# EAGLE design IP_04_00_000-PendulumSchem (EAGLE 9.6.2)
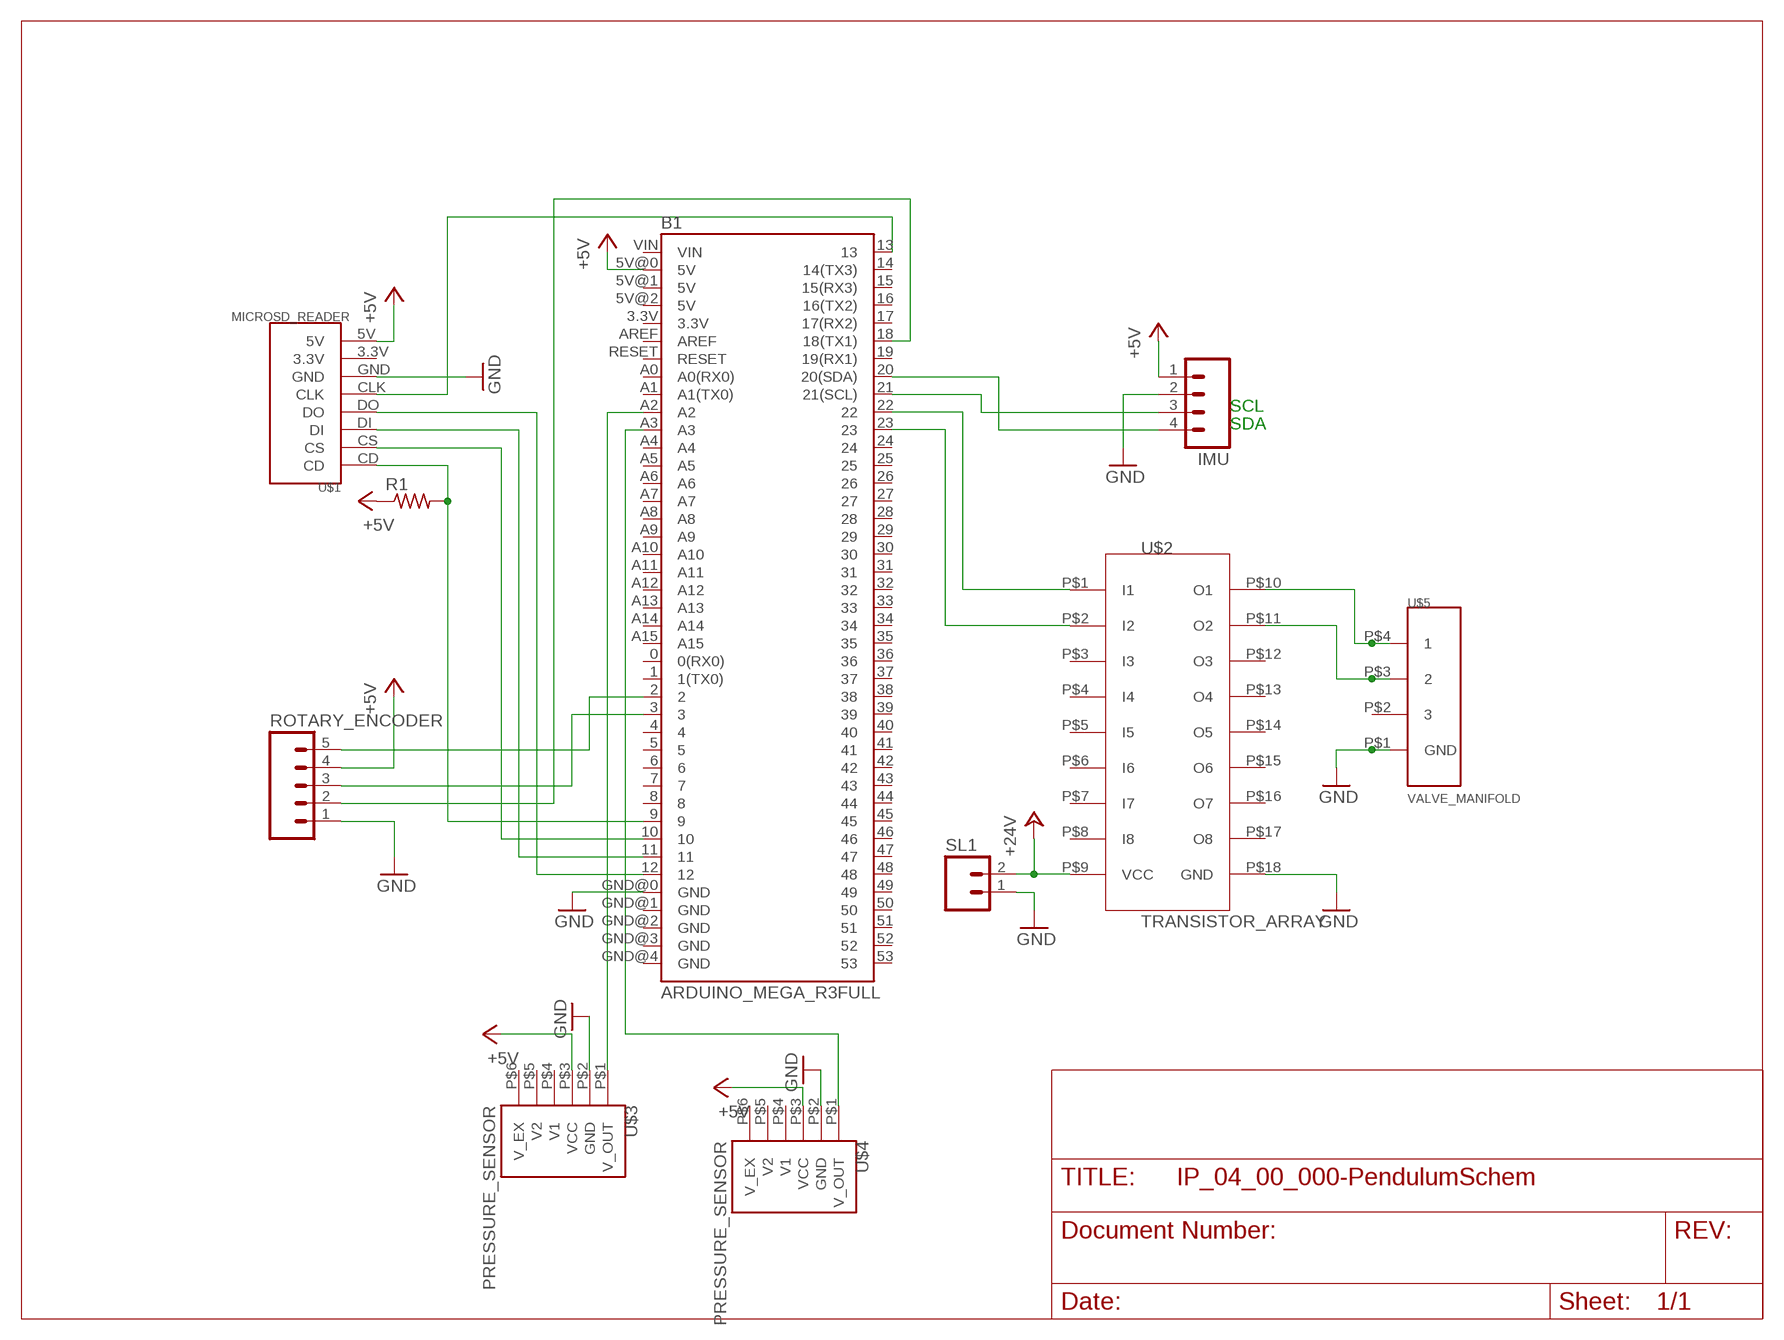
[diagram p0: schematic, sheet 1]

## Parts
B1  ARDUINO_MEGA_R3FULL  [ARDUINO_MEGA]
IMU  M04  [04P]
R1  R-US_0204/7  [0204/7]
ROTARY_ENCODER  M05  [05P]
SL1  M02  [02P]
U$1  MICROSD_READER  [MICROSD_READER]
U$2  TRANSISTOR_ARRAY  [TRANSISTOR_ARRAY]
U$3  PRESSURE_SENSOR  [PRESSURE_SENSOR]
U$4  PRESSURE_SENSOR  [PRESSURE_SENSOR]
U$5  VALVE_MANIFOLD  [VALVE_MANIFOLD]

## Nets
+5V: B1.5V@0(5V) IMU.1 R1.1 ROTARY_ENCODER.4 U$1.5V U$3.P$3(VCC) U$4.P$3(VCC)
+24V: SL1.2 U$2.P$9(VCC)
GND: B1.GND@0(GND) IMU.2 ROTARY_ENCODER.1 SL1.1 U$1.GND U$2.P$18(GND) U$3.P$2(GND) U$4.P$2(GND) U$5.P$1(GND)
N$1: B1.3 ROTARY_ENCODER.3
N$2: B1.20(20(SDA)) IMU.4
N$3: B1.21(21(SCL)) IMU.3
N$4: B1.2 ROTARY_ENCODER.5
N$5: B1.22 U$2.P$1(I1)
N$6: U$2.P$10(O1) U$5.P$4
N$7: B1.18(18(TX1)) ROTARY_ENCODER.2
N$8: U$2.P$11(O2) U$5.P$3
N$10: B1.23 U$2.P$2(I2)
N$11: B1.13 U$1.CLK
N$12: B1.A2 U$3.P$1(V_OUT)
N$13: B1.12 U$1.DO
N$14: B1.A3 U$4.P$1(V_OUT)
N$15: B1.11 U$1.DI
N$16: B1.10 U$1.CS
N$18: B1.9 R1.2 U$1.CD
Unconnected: B1.0(0(RX0)) B1.1(1(TX0)) B1.3.3V B1.4 B1.5 B1.5V@1(5V) B1.5V@2(5V) B1.6 B1.7 B1.8 B1.14(14(TX3)) B1.15(15(RX3)) B1.16(16(TX2)) B1.17(17(RX2)) B1.19(19(RX1)) B1.24 B1.25 B1.26 B1.27 B1.28 B1.29 B1.30 B1.31 B1.32 B1.33 B1.34 B1.35 B1.36 B1.37 B1.38 B1.39 B1.40 B1.41 B1.42 B1.43 B1.44 B1.45 B1.46 B1.47 B1.48 B1.49 B1.50 B1.51 B1.52 B1.53 B1.A0(A0(RX0)) B1.A1(A1(TX0)) B1.A4 B1.A5 B1.A6 B1.A7 B1.A8 B1.A9 B1.A10 B1.A11 B1.A12 B1.A13 B1.A14 B1.A15 B1.AREF B1.GND@1(GND) B1.GND@2(GND) B1.GND@3(GND) B1.GND@4(GND) B1.RESET B1.VIN U$1.3.3V U$2.P$3(I3) U$2.P$4(I4) U$2.P$5(I5) U$2.P$6(I6) U$2.P$7(I7) U$2.P$8(I8) U$2.P$12(O3) U$2.P$13(O4) U$2.P$14(O5) U$2.P$15(O6) U$2.P$16(O7) U$2.P$17(O8) U$3.P$4(V1) U$3.P$5(V2) U$3.P$6(V_EX) U$4.P$4(V1) U$4.P$5(V2) U$4.P$6(V_EX) U$5.P$2

## Notes on the sheet
- SCL
- SDA

## Library data of the parts
B1 = SparkFun-Boards-deleted2holes:ARDUINO_MEGA_R3: Arduino Mega R3 ATmega2560 R3 compatible footprint. SparkFun Products: Arduino Mega 2560 R3 <https://www.sparkfun.com/products/11061>
IMU = con-amp-quick:M04: AMP QUICK CONNECTOR; OC_FARNELL: unknown; OC_NEWARK: unknown
R1 = rcl:R-US_: RESISTOR, American symbol; SPICEPREFIX: R
ROTARY_ENCODER = con-amp-quick:M05: AMP QUICK CONNECTOR; OC_FARNELL: unknown; OC_NEWARK: unknown
SL1 = con-amp-quick:M02: AMP QUICK CONNECTOR; OC_FARNELL: unknown; OC_NEWARK: unknown
U$1 = IPcustomDevices:MICROSD_READER
U$2 = IPcustomDevices:TRANSISTOR_ARRAY
U$3 U$4 = IPcustomDevices:PRESSURE_SENSOR
U$5 = IPcustomDevices:VALVE_MANIFOLD

## Board
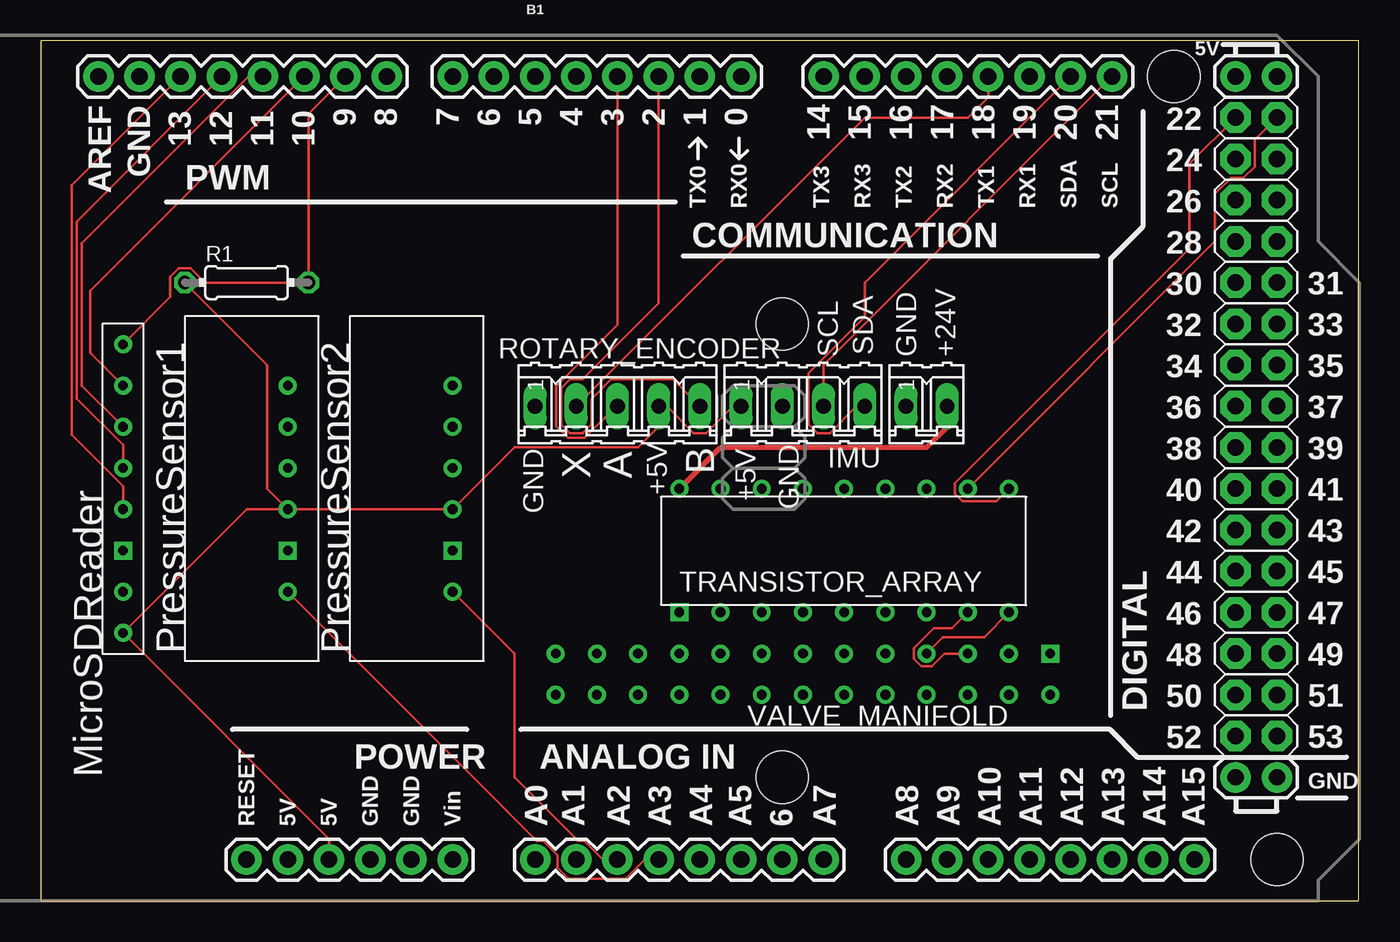
[diagram p1: board, top side]
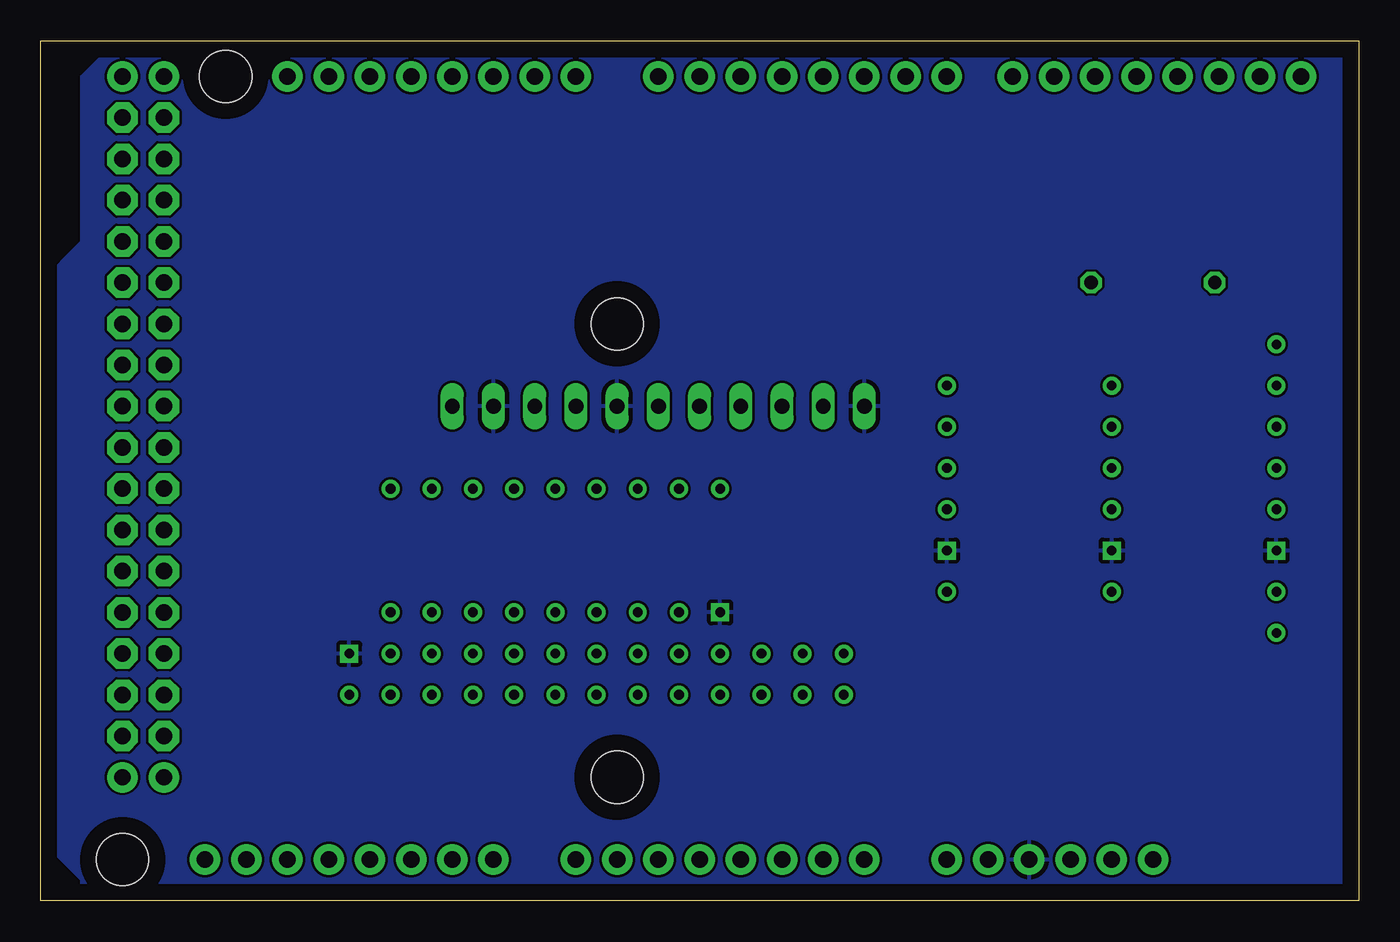
[diagram p2: board, bottom side, seen from below]

Size 81.26 x 53.01 mm. Coordinates in mm from the lower left corner, seen from the top.
Outline: 0,0 81.26,0 81.26,53.01 0,53.01 0,0
Copper layers (1*16): Top 0.035mm / dielectric 1.5mm / Bottom 0.035mm
Design rules "default": minimum track width 6mil, minimum drill 0.35mm, track to track 6mil, track to pad 6mil, pad to pad 6mil, via to via 6mil, smd to smd 6mil, copper to edge 40mil, drill to drill 6mil, minimum pad ring 10mil, minimum via ring 8mil, stop-mask expansion 4mil, vias tented up to drill 0mil, thermal gap 10mil

### Footprints (pad centres in the part's own frame; a part is rotated, then mirrored left to right if it is on the bottom)
ARDUINO_MEGA = drill 1.016 pad 1.88: 0 13.97,24.13; 1 11.43,24.13; 2 8.89,24.13; 3 6.35,24.13; 3.3V -13.97,-24.13; 4 3.81,24.13; 5 1.27,24.13; 5V@0 -11.43,-24.13; 5V@1 44.45,24.13; 5V@2 46.99,24.13; 6 -1.27,24.13; 7 -3.81,24.13; 8 -7.874,24.13; 9 -10.414,24.13; 10 -12.954,24.13; 11 -15.494,24.13; 12 -18.034,24.13; 13 -20.574,24.13; 14 19.05,24.13; 15 21.59,24.13; 16 24.13,24.13; 17 26.67,24.13; 18 29.21,24.13; 19 31.75,24.13; 20 34.29,24.13; 21 36.83,24.13; A0 1.27,-24.13; A1 3.81,-24.13; A2 6.35,-24.13; A3 8.89,-24.13; A4 11.43,-24.13; A5 13.97,-24.13; A6 16.51,-24.13; A7 19.05,-24.13; A8 24.13,-24.13; A9 26.67,-24.13; A10 29.21,-24.13; A11 31.75,-24.13; A12 34.29,-24.13; A13 36.83,-24.13; A14 39.37,-24.13; A15 41.91,-24.13; AREF -25.654,24.13; GND@0 -8.89,-24.13; GND@1 -6.35,-24.13; GND@2 44.45,-19.05; GND@3 46.99,-19.05; GND@4 -23.114,24.13; RESET -16.51,-24.13; VIN -3.81,-24.13 | drill 1.016 pad 1.88 octagon: 22 44.45,21.59; 23 46.99,21.59; 24 44.45,19.05; 25 46.99,19.05; 26 44.45,16.51; 27 46.99,16.51; 28 44.45,13.97; 29 46.99,13.97; 30 44.45,11.43; 31 46.99,11.43; 32 44.45,8.89; 33 46.99,8.89; 34 44.45,6.35; 35 46.99,6.35; 36 44.45,3.81; 37 46.99,3.81; 38 44.45,1.27; 39 46.99,1.27; 40 44.45,-1.27; 41 46.99,-1.27; 42 44.45,-3.81; 43 46.99,-3.81; 44 44.45,-6.35; 45 46.99,-6.35; 46 44.45,-8.89; 47 46.99,-8.89; 48 44.45,-11.43; 49 46.99,-11.43; 50 44.45,-13.97; 51 46.99,-13.97; 52 44.45,-16.51; 53 46.99,-16.51 | hole 3.2: 16.51,8.89; 16.51,-19.05; 40.64,24.13; 46.99,-24.13
04P = drill 0.914 long: 1 -3.81,0; 2 -1.27,0; 3 1.27,0; 4 3.81,0
0204/7 = drill 0.813 octagon: 1 -3.81,0; 2 3.81,0
05P = drill 0.914 long: 1 -5.08,0; 2 -2.54,0; 3 0,0; 4 2.54,0; 5 5.08,0
02P = drill 0.914 long: 1 -1.27,0; 2 1.27,0
MICROSD_READER = drill 0.6: 3.3V 0,-2.54; 5V 0,-5.08; CD 0,12.7; CLK 0,2.54; CS 0,10.16; DI 0,7.62; DO 0,5.08 | drill 0.6 square: GND 0,0
TRANSISTOR_ARRAY = drill 0.6: P$1 0,0; P$2 0,-2.54; P$3 0,-5.08; P$4 0,-7.62; P$5 0,-10.16; P$6 0,-12.7; P$7 0,-15.24; P$8 0,-17.78; P$9 0,-20.32; P$10 7.62,0; P$11 7.62,-2.54; P$12 7.62,-5.08; P$13 7.62,-7.62; P$14 7.62,-10.16; P$15 7.62,-12.7; P$16 7.62,-15.24; P$17 7.62,-17.78 | drill 0.6 square: P$18 7.62,-20.32
PRESSURE_SENSOR = drill 0.6: P$1 0,0; P$3 0,5.08; P$4 0,7.62; P$5 0,10.16; P$6 0,12.7 | drill 0.6 square: P$2 0,2.54
VALVE_MANIFOLD = drill 0.6 square: P$1 0,0 | drill 0.6: P$2 0,2.54; P$3 0,5.08; P$4 0,7.62; P$5 0,10.16; P$6 0,12.7; P$7 0,15.24; P$8 0,17.78; P$9 0,20.32; P$10 0,22.86; P$11 0,25.4; P$12 0,27.94; P$13 0,30.48; P$14 2.54,0; P$15 2.54,2.54; P$16 2.54,5.08; P$17 2.54,7.62; P$18 2.54,10.16; P$19 2.54,12.7; P$20 2.54,15.24; P$21 2.54,17.78; P$22 2.54,20.32; P$23 2.54,22.86; P$24 2.54,25.4; P$25 2.54,27.94; P$26 2.54,30.48

### Placement (x,y rotation side)
B1  29.21,26.67 0 top
IMU  46.99,30.48 0 top
R1  12.7,38.1 0 top
ROTARY_ENCODER  35.56,30.48 0 top
SL1  54.61,30.48 0 top
U$1  5.08,21.59 0 top
U$2  59.69,25.4 270 top
U$3  25.4,19.05 0 top
U$4  15.24,19.05 0 top
U$5  62.23,15.24 270 bottom

### Tracks (layer width: path | path; a pad name or v marks a point on that pad's centre or on a via)
+5V
  Top 0.152: U$4.P$3 U$3.P$3 29.21,27.94 36.83,27.94 38.1,29.21 ROTARY_ENCODER.4 38.6,30.48 40.25,28.83 41.03,28.83 42.68,30.48 IMU.1 | U$4.P$3 12.7,24.13 U$1.5V 17.78,3.81 B1.5V@0 | R1.1 13.97,33.02 13.97,25.4 U$4.P$3
+24V
  Top 0.305: U$2.P$9 41.91,27.94 54.61,27.94 55.88,29.21 SL1.2
GND
  Bottom 0.152: U$4.P$2 15.24,21.75
  pour Bottom: 0,53.34 76.2,53.34 78.74,50.8 78.74,40.64 81.28,38.1 81.28,3.81 78.74,1.27 78.74,0 0,0
N$1
  Top 0.152: B1.3 35.56,35.49 31.77,31.71 31.77,29.25 32.5,28.52 33.54,28.52 35.49,30.48 ROTARY_ENCODER.3
N$2
  Top 0.152: B1.20 50.8,38.1 50.8,35.99 47.32,32.51 47.32,29.38 47.87,28.83 48.65,28.83 50.3,30.48 IMU.4
N$3
  Top 0.152: IMU.3 48.26,33.02 B1.21
N$4
  Top 0.152: ROTARY_ENCODER.5 38.99,32.13 35.17,32.13 33.96,30.92 33.96,29.38 33.41,28.83 32.63,28.83 32.08,29.38 32.08,31.58 32.63,32.13 33.4,32.13 38.1,36.83 B1.2
N$5
  Top 0.152: B1.22 70.81,45.41 70.81,40.17 56.37,25.72 56.37,25.08 56.83,24.62 58.91,24.62 U$2.P$1
N$6
  Top 0.152: U$5.P$4 55.63,16.26 58.17,16.26 U$2.P$10
N$7
  Top 0.152: ROTARY_ENCODER.2 50.8,48.26 57.15,48.26 58.42,49.53 B1.18
N$8
  Top 0.152: U$2.P$11 56.19,16.82 55.08,16.82 53.83,15.56 53.83,14.92 54.29,14.46 54.93,14.46 55.72,15.24 U$5.P$3
N$10
  Top 0.152: B1.23 74.83,46.89 74.83,45.24 74.14,44.55 73.38,44.55 72.39,43.56 72.39,40.64 U$2.P$2
N$11
  Top 0.152: U$1.CLK 5.08,25.56 1.93,28.71 1.93,44.09 B1.13
N$12
  Top 0.152: U$3.P$1 29.21,15.24 29.21,7.62 33.12,3.71 33.5,3.71 34.67,2.54 B1.A2
N$13
  Top 0.152: U$1.DO 5.08,28.1 2.23,30.95 2.23,41.86 B1.12
N$14
  Top 0.152: U$4.P$1 30.58,3.71 30.96,3.71 31.85,2.82 31.85,2.06 32.54,1.37 36.04,1.37 37.21,2.54 B1.A3
N$15
  Top 0.152: U$1.DI 2.54,31.75 2.54,40.51 12.83,50.8 B1.11
N$16
  Top 0.152: 5.08,31.91 U$1.CS 3.05,33.78 3.05,37.59 B1.10
N$18
  Top 0.152: U$1.CD 8,37.21 8,38.47 8.52,38.99 9.26,38.99 10.15,38.1 R1.2 16.51,48.51 B1.9

### Text on the board
tPlace: SCL | SDA | GND | +24V | X | A | B | +5V | +5V | GND | GND | TRANSISTOR_ARRAY | PressureSensor1 | PressureSensor2 | VALVE_MANIFOLD | MicroSDReader